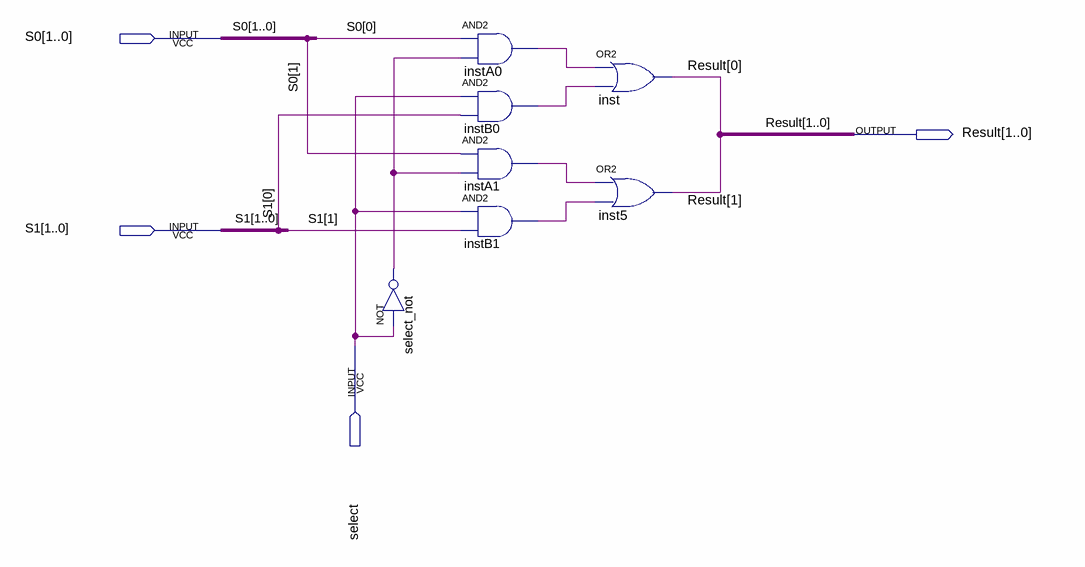
[diagram p0: schematic sheet]
// Quartus schematic mux.bdf as structural Verilog: 7 symbols, 4 pins
module mux (
  input  [1:0] S0,
  input  [1:0] S1,
  input  select,
  output [1:0] Result
);

  wire instA0_out, instA1_out, instB0_out, instB1_out, select_not_out;

  not select_not (select_not_out, select);
  and instA0 (instA0_out, S0[0], select_not_out);
  and instB0 (instB0_out, select, S1[0]);
  and instA1 (instA1_out, S0[1], select_not_out);
  and instB1 (instB1_out, select, S1[1]);
  or inst (Result[0], instA0_out, instB0_out);
  or inst5 (Result[1], instA1_out, instB1_out);
endmodule
